# Altium schematic sheet Power Tree.SchDoc
size A4; SheetNumber: 2; SheetTotal: 9
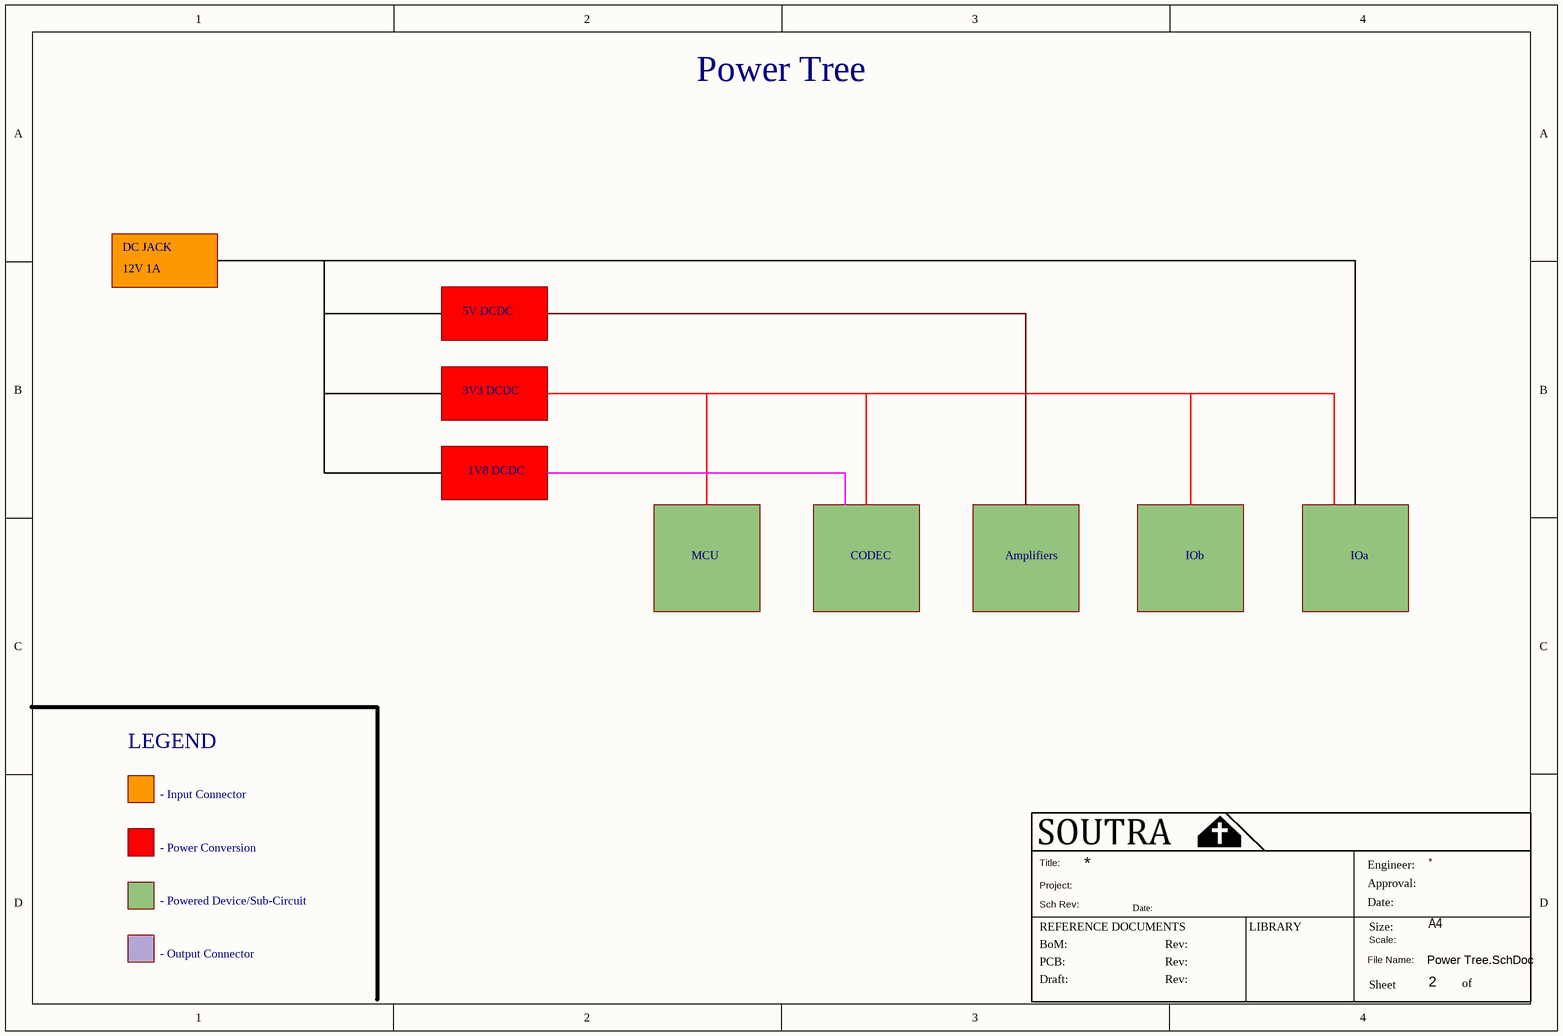
[diagram p0: Power Tree.SchDoc]

## Notes on the sheet
- Power Tree
- DC JACK
- 12V 1A
- 5V DCDC
- 3V3 DCDC
- 1V8 DCDC
- MCU
- CODEC
- Amplifiers
- IOb
- IOa
- LEGEND
- - Input Connector
- - Power Conversion
- - Powered Device/Sub-Circuit
- Title:
- Project:
- Sch Rev:
- Date:
- Engineer:
- Approval:
- - Output Connector
- REFERENCE DOCUMENTS
- BoM:
- PCB:
- Draft:
- Rev:
- LIBRARY
- File Name:
- Scale:
- Size:
- Sheet
- A4
- of